# EAGLE design fact-atmega32u4 (EAGLE 6.5.0)
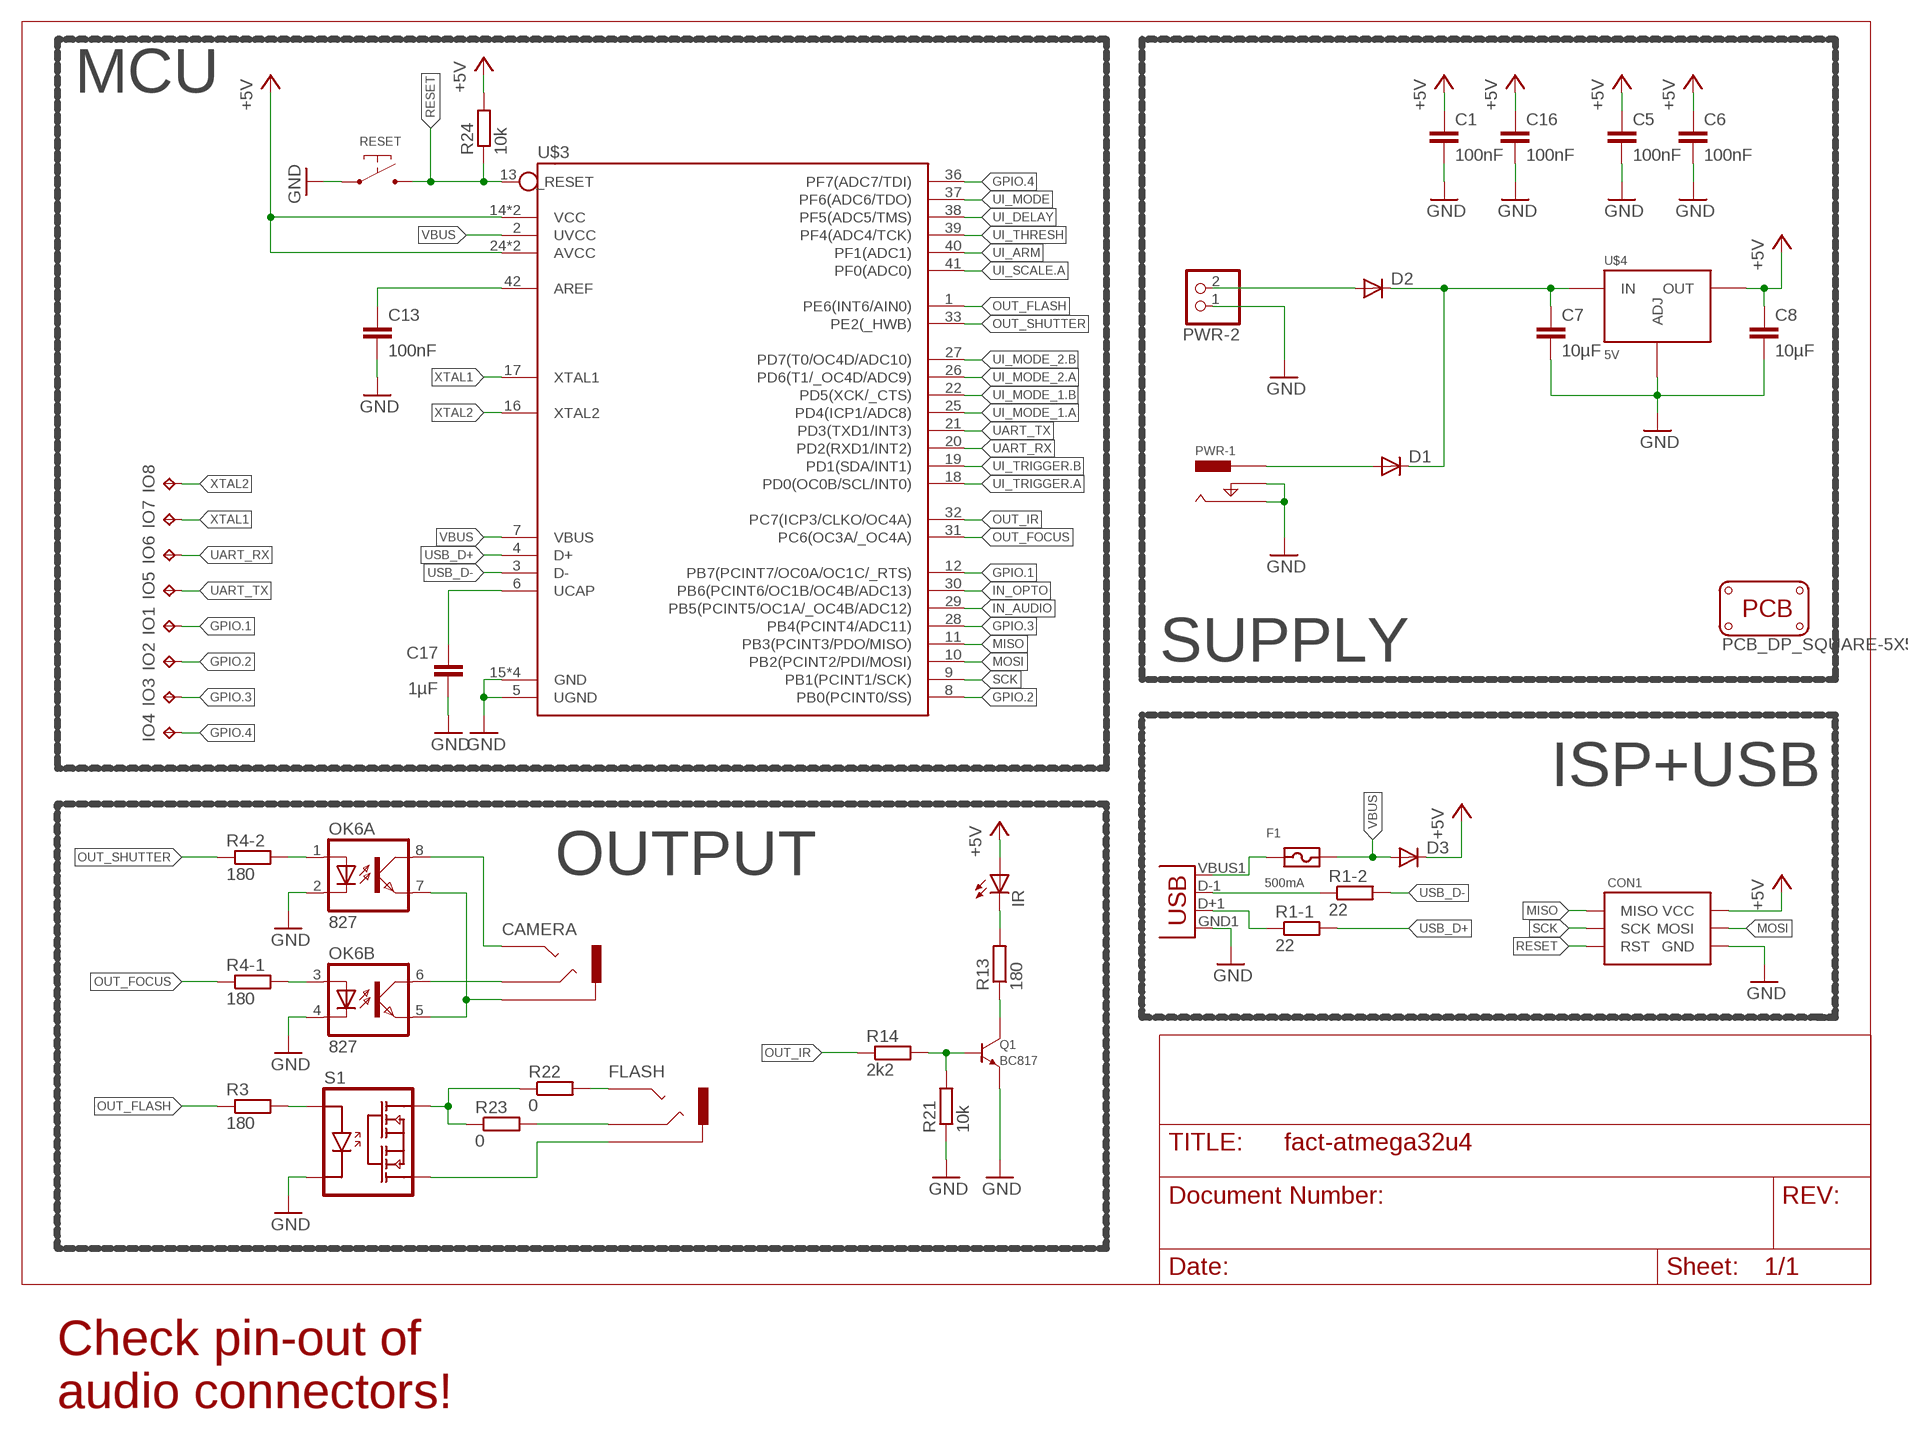
[diagram p0: schematic, sheet 1, part 1 of 2]
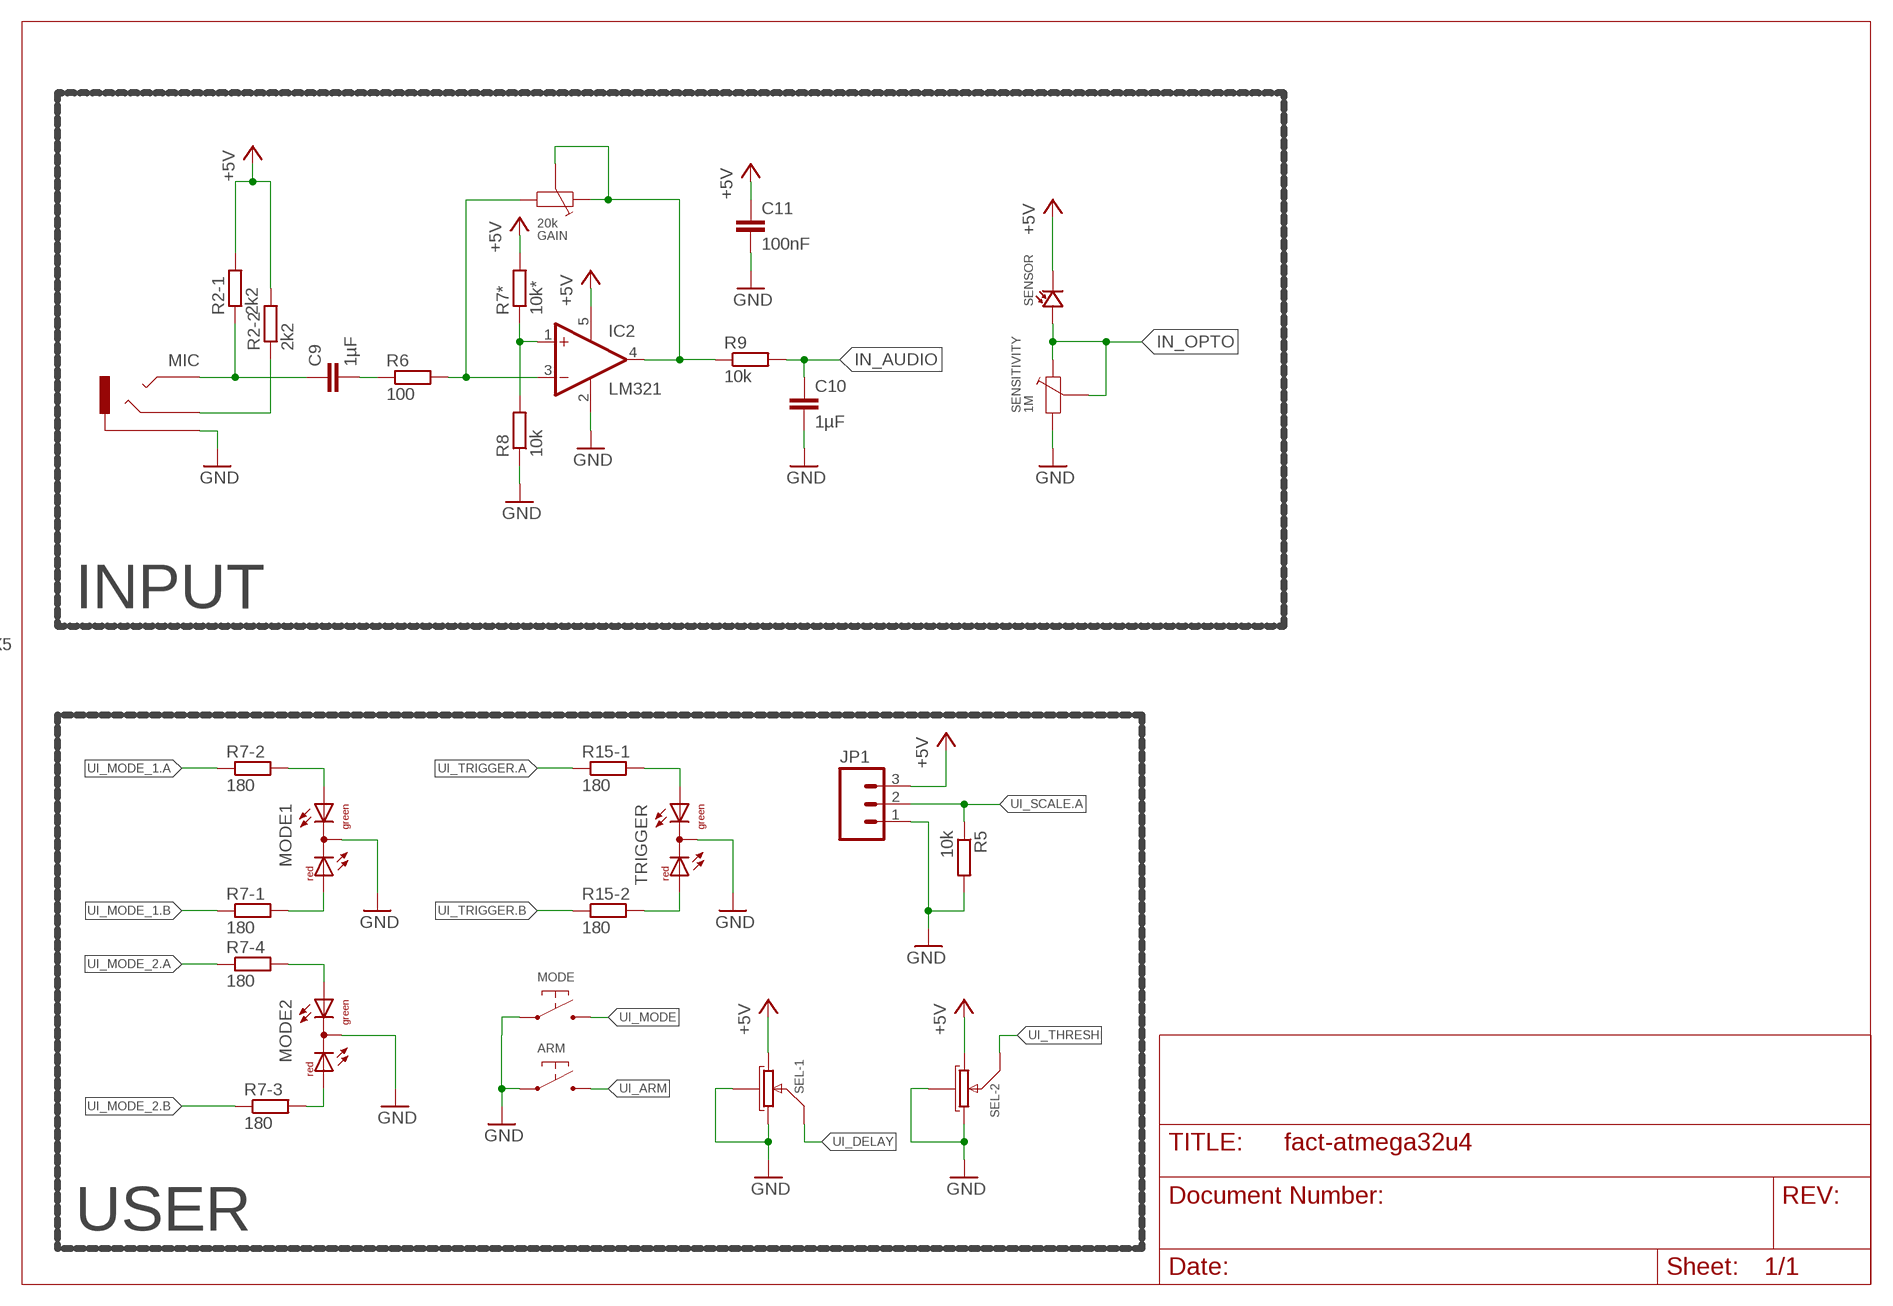
[diagram p1: schematic, sheet 1, part 2 of 2]

## Parts
ARM  SWITCH-DEFAULT_OFF-DEFAULT  [SWITCH-GENERIC-4_PIN]
C1  100nF  C-EUC0603  [C0603]
C5  100nF  C-EUC0603  [C0603]
C6  100nF  C-EUC0603  [C0603]
C7  10µF  C-EUC0603  [C0603]
C8  10µF  C-EUC0603  [C0603]
C9  1µF  C-EUC0603  [C0603]
C10  1µF  C-EUC0603  [C0603]
C11  100nF  C-EUC0603  [C0603]
C13  100nF  C-EUC0603  [C0603]
C16  100nF  C-EUC0603  [C0603]
C17  1µF  C-EUC0603  [C0603]
CAMERA  AUDIO-STEREO2MM5  [AUDIO-STEREO-2MM5-SJ1-2503A]
CON1  ISP-6_PIN-POGO  [POGO-1.27-6_PIN-MADWORM]
D1  DIODESOD  [SOD-323]
D2  DIODESOD  [SOD-323]
D3  DIODESOD  [SOD-323]
F1  500mA  FUSE0805  [SMD-0805]
FLASH  AUDIO-STEREODEALEXTREME  [AUDIO-STEREO-3MM5-ST-009]
GAIN  20k  TRIM-POT  [TRIM-POT-CA6-VS5]
IC2  LM321  LM321MF  [SOT23-5]
IO1  TPTP15R  [TP15R]
IO2  TPTP15R  [TP15R]
IO3  TPTP15R  [TP15R]
IO4  TPTP15R  [TP15R]
IO5  TPTP15R  [TP15R]
IO6  TPTP15R  [TP15R]
IO7  TPTP15R  [TP15R]
IO8  TPTP15R  [TP15R]
IR  LED5MM  [LED5MM]
JP1  M03LOCK  [1X03_LOCK]
MIC  AUDIO-STEREODEALEXTREME  [AUDIO-STEREO-3MM5-ST-009]
MODE  SWITCH-DEFAULT_OFF-DEFAULT  [SWITCH-GENERIC-4_PIN]
MODE1  DUOLED-RG-C  [DUOLED-C-5MM]
MODE2  DUOLED-RG-C  [DUOLED-C-5MM]
OK6  827  OPTOCOUPLER-PC827SMD  [SMD08]
PCB1  PCB_DP_SQUARE-5X5  [DP5050_V1]
PWR-1  POWER-BARREL_JACKEBAY  [POWER-BARREL-2MM1-EBAY]
PWR-2  PINHD-1X2  [1X02]
Q1  BC817  TRANSISTOR-NPN-GENERIC-BEC  [SOT23]
R1  22  R-ARRAY-2X-0603  [R-ARRAY-2X-0603]
R2  2k2  R-ARRAY-2X-0603  [R-ARRAY-2X-0603]
R3  180  R-EU_R0603  [R0603]
R4  180  R-ARRAY-2X-0603  [R-ARRAY-2X-0603]
R5  10k  R-EU_R0603  [R0603]
R6  100  R-EU_R0603  [R0603]
R7  180  R-ARRAY-4X0603  [R-ARRAY-4X-CTS-0603]
R7*  10k*  R-EU_R0603  [R0603]
R8  10k  R-EU_R0603  [R0603]
R9  10k  R-EU_R0603  [R0603]
R13  180  R-EU_R0603  [R0603]
R14  2k2  R-EU_R0603  [R0603]
R15  180  R-ARRAY-2X-0603  [R-ARRAY-2X-0603]
R21  10k  R-EU_R0603  [R0603]
R22  0  R-EU_R1206  [R1206]
R23  0  R-EU_R1206  [R1206]
R24  10k  R-EU_R0603  [R0603]
RESET  SWITCH-DEFAULT_OFF-SMD-2_PIN  [SWITCH-SMD-2_PIN-DX]
S1  RELAYLH1500  [SMD-06]
SEL  DUAL-POT  [POT-DUAL-P090]
SENSITIVITY  1M  TRIM-POT  [TRIM-POT-CA6-VS5]
SENSOR  PHOTODIODE  [LED-5MM]
TRIGGER  DUOLED-RG-C  [DUOLED-C-5MM]
U$3  ATMEGA32U4-QFN-HAND  [QFN-44-NOPAD-LONGLEADS]
U$4  5V  REGULATOR-TLV1117SOT223  [SOT223]
U$5  USB  [USB-AB-MICRO-SMD_V03]

## Nets
+5V: C1.1 C5.1 C6.1 C8.1 C11.1 C16.1 CON1.P$2(VCC) D3.1(C) IC2.5(V+) IR.A JP1.3 R2.P$1.2 R2.P$2.2 R7*.2 R24.2 SEL.P1-3(-1:B) SEL.P2-1(-2:A) SENSOR.K(C) U$3.14(VCC) U$3.24(AVCC) U$3.34(VCC) U$3.44(AVCC) U$4.2(OUT) U$4.4(OUT)
GND: ARM.P$1 ARM.P$2 C1.2 C5.2 C6.2 C7.2 C8.2 C10.2 C11.2 C13.2 C16.2 C17.2 CON1.P$6(GND) IC2.2(V-) JP1.1 MIC.P$1.1(SLEEVE) MIC.P$1.2(SLEEVE) MODE1.C MODE2.C MODE.P$1 MODE.P$2 OK6.2(A:C) OK6.4(B:C) PWR-1.P$2(SWITCH) PWR-1.P$3(OUTER) PWR-2.1 Q1.P$2(EMITTER) R5.2 R8.1 R21.1 RESET.P$1 S1.2(LED-C) SEL.CENTER(-1:SHIELD) SEL.G1-S(-1:SHIELD) SEL.G2-S(-2:SHIELD) SEL.P1-1(-1:A) SEL.P2-3(-2:B) SENSITIVITY.P$2 TRIGGER.C U$3.5(UGND) U$3.15(GND) U$3.23(GND) U$3.35(GND) U$3.43(GND) U$4.1(ADJ) U$5.GND1(GND)
GPIO.1: IO1.TP U$3.12(PB7(PCINT7/OC0A/OC1C/_RTS))
GPIO.2: IO2.TP U$3.8(PB0(PCINT0/SS))
GPIO.3: IO3.TP U$3.28(PB4(PCINT4/ADC11))
GPIO.4: IO4.TP U$3.36(PF7(ADC7/TDI))
HV_OUT: R22.1 R23.1 S1.6(R1)
HV_RING: FLASH.P$2(RING) R23.2
HV_SLEEVE: FLASH.P$1.1(SLEEVE) FLASH.P$1.2(SLEEVE) S1.4(R2)
HV_TIP: FLASH.P$3.1(TIP) FLASH.P$3.2(TIP) R22.2
IN_AUDIO: C10.1 R9.2 U$3.29(PB5(PCINT5/OC1A/_OC4B/ADC12))
IN_OPTO: SENSITIVITY.CENTER SENSITIVITY.P$1 SENSOR.A U$3.30(PB6(PCINT6/OC1B/OC4B/ADC13))
MISO: CON1.P$1(MISO) U$3.11(PB3(PCINT3/PDO/MISO))
MOSI: CON1.P$4(MOSI) U$3.10(PB2(PCINT2/PDI/MOSI))
N$2: C7.1 D1.1(C) D2.1(C) U$4.3(IN)
N$3: F1.1 U$5.VBUS1(VBUS)
N$4: R1.P$2.1 U$5.D-1(D-)
N$5: D1.2(A) PWR-1.P$4(CENTER)
N$7: R1.P$1.1 U$5.D+1(D+)
N$9: D2.2(A) PWR-2.2
N$15: CAMERA.P$1(SLEEVE) OK6.5(B:EMIT) OK6.7(A:EMIT)
N$16: CAMERA.P$4(RING) OK6.6(B:COL)
N$17: CAMERA.P$2(TIP) CAMERA.P$3(TIP) OK6.8(A:COL)
N$18: OK6.1(A:A) R4.P$2.2
N$19: MIC.P$2(RING) R2.P$2.1
N$20: C9.1 MIC.P$3.1(TIP) MIC.P$3.2(TIP) R2.P$1.1
N$21: IC2.1(+IN) R7*.1 R8.2
N$22: C9.2 R6.1
N$23: GAIN.P$2 IC2.3(-IN) R6.2
N$24: GAIN.CENTER GAIN.P$1 IC2.4(OUT) R9.1
N$25: R3.2 S1.1(LED-A)
N$26: OK6.3(B:A) R4.P$1.2
N$27: Q1.P$3(COLLECTOR) R13.1
N$28: IR.K(C) R13.2
N$29: Q1.P$1(BASE) R14.2 R21.2
N$30: MODE1.AX(AG) R7.P$2.2
N$31: MODE1.AR R7.P$1.2
N$32: R15.P$1.2 TRIGGER.AX(AG)
N$33: R15.P$2.2 TRIGGER.AR
N$37: MODE2.AX(AG) R7.P$4.2
N$38: MODE2.AR R7.P$3.2
N$39: C13.1 U$3.42(AREF)
N$42: C17.1 U$3.6(UCAP)
OUT_FLASH: R3.1 U$3.1(PE6(INT6/AIN0))
OUT_FOCUS: R4.P$1.1 U$3.31(PC6(OC3A/_OC4A))
OUT_IR: R14.1 U$3.32(PC7(ICP3/CLKO/OC4A))
OUT_SHUTTER: R4.P$2.1 U$3.33(PE2(_HWB))
RESET: CON1.P$5(RST) R24.1 RESET.P$2 U$3.13(_RESET)
SCK: CON1.P$3(SCK) U$3.9(PB1(PCINT1/SCK))
UART_RX: IO6.TP U$3.20(PD2(RXD1/INT2))
UART_TX: IO5.TP U$3.21(PD3(TXD1/INT3))
UI_ARM: ARM.P$3 ARM.P$4 U$3.40(PF1(ADC1))
UI_DELAY: SEL.P1-2(-1:M) U$3.38(PF5(ADC5/TMS))
UI_MODE: MODE.P$3 MODE.P$4 U$3.37(PF6(ADC6/TDO))
UI_MODE_1.A: R7.P$2.1 U$3.25(PD4(ICP1/ADC8))
UI_MODE_1.B: R7.P$1.1 U$3.22(PD5(XCK/_CTS))
UI_MODE_2.A: R7.P$4.1 U$3.26(PD6(T1/_OC4D/ADC9))
UI_MODE_2.B: R7.P$3.1 U$3.27(PD7(T0/OC4D/ADC10))
UI_SCALE.A: JP1.2 R5.1 U$3.41(PF0(ADC0))
UI_THRESH: SEL.P2-2(-2:M) U$3.39(PF4(ADC4/TCK))
UI_TRIGGER.A: R15.P$1.1 U$3.18(PD0(OC0B/SCL/INT0))
UI_TRIGGER.B: R15.P$2.1 U$3.19(PD1(SDA/INT1))
USB_D+: R1.P$1.2 U$3.4(D+)
USB_D-: R1.P$2.2 U$3.3(D-)
VBUS: D3.2(A) F1.2 U$3.2(UVCC) U$3.7(VBUS)
XTAL1: IO7.TP U$3.17(XTAL1)
XTAL2: IO8.TP U$3.16(XTAL2)

## Notes on the sheet
- MCU
- INPUT
- SUPPLY
- ISP+USB
- OUTPUT
- USER
- Check pin-out of
  audio connectors!

## Library data of the parts
ARM MODE RESET = p.peter-passives:SWITCH-DEFAULT_OFF
C1 C5-C11 C13 C16 C17 = p.peter-rcl:C-EU: CAPACITOR, European symbol
CAMERA = p.peter-connectors:AUDIO-STEREO: Conrad 3.5mm Stereo 0.66EUR Best.-Nr.: 733962 - 62; OC_DIGIKEY: CP1-2503A-ND
CON1 = p.peter-connectors:ISP-6_PIN: AVR 6 PIN ISP header Edge connector normal layout
D1-D3 = SparkFun-DiscreteSemi:DIODE: Diode These are standard reverse protection diodes and small signal diodes. SMA package can handle up to about 1A. SOD-323 can handle about 200mA. What the SOD-323 package when ordering, there are some mfgs out there that are 5-pin packages.; PROD_ID: DIO-09646
F1 = p.peter-regulators:FUSE
FLASH MIC = p.peter-connectors:AUDIO-STEREO: Conrad 3.5mm Stereo 0.66EUR Best.-Nr.: 733962 - 62; DX: http://dx.com/p/st-009-diy-3-5mm-stereo-audio-jack-20-piece-pack-123457; OC_CONRAD: 733962 - 62
GAIN SENSITIVITY = p.peter-passives:TRIM-POT
IC2 = linear:LM321?*: Low Power Single Op Amp Source: http://cache.national.com/ds/LM/LM321.pdf
IO1-IO8 = testpad:TP: Test pad
IR = led:LED: LED OSRAM: - CHIPLED LG R971, LG N971, LY N971, LG Q971, LY Q971, LO R971, LY R971 LH N974, LH R974 LS Q976, LO Q976, LY Q976 LO Q996 - Hyper CHIPLED LW Q18S LB Q993, LB Q99A, LB R99A - SideLED LS A670, LO A670, LY A670, LG A670, LP A670 LB A673, LV A673, LT A673, LW A673 LH A674 LY A675 LS A676, LA A676, LO A676, LY A676, LW A676 LS A679, LY A679, LG A679 - Hyper Micro SIDELED® LS Y876, LA Y876, LO Y876, LY Y876 LT Y87S - SmartLED LW L88C, LW L88S LB L89C, LB L89S, LG L890 LS L89K, LO L89K, LY L89K LS L896, LA L896, LO L896, LY L896 - TOPLED LS T670, LO T670, LY T670, LG T670, LP T670 LSG T670, LSP T670, LSY T670, LOP T670, LYG T670 LG T671, LOG T671, LSG T671 LB T673, LV T673, LT T673, LW T673 LH T674 LS T676, LA T676, LO T676, LY T676, LB T676, LH T676, LSB T676, LW T676 LB T67C, LV T67C, LT T67C, LS T67K, LO T67K, LY T67K, LW E67C LS E67B, LA E67B, LO E67B, LY E67B, LB E67C, LV E67C, LT E67C LW T67C LS T679, LY T679, LG T679 LS T770, LO T770, LY T770, LG T770, LP T770 LB T773, LV T773, LT T773, LW T773 LH T774 LS E675, LA E675, LY E675, LS T675 LS T776, LA T776, LO T776, LY T776, LB T776 LHGB T686 LT T68C, LB T68C - Hyper Mini TOPLED® LB M676 - Mini TOPLED Santana® LG M470 LS M47K, LO M47K, LY M47K Source: http://www.osram.convergy.de LUXEON: - LUMILED® LXK2-PW12-R00, LXK2-PW12-S00, LXK2-PW14-U00, LXK2-PW14-V00 LXK2-PM12-R00, LXK2-PM12-S00, LXK2-PM14-U00 LXK2-PE12-Q00, LXK2-PE12-R00, LXK2-PE12-S00, LXK2-PE14-T00, LXK2-PE14-U00 LXK2-PB12-K00, LXK2-PB12-L00, LXK2-PB12-M00, LXK2-PB14-N00, LXK2-PB14-P00, LXK2-PB14-Q00 LXK2-PR12-L00, LXK2-PR12-M00, LXK2-PR14-Q00, LXK2-PR14-R00 LXK2-PD12-Q00, LXK2-PD12-R00, LXK2-PD12-S00 LXK2-PH12-R00, LXK2-PH12-S00 LXK2-PL12-P00, LXK2-PL12-Q00, LXK2-PL12-R00 Source: www.luxeon.com KINGBRIGHT: KA-3528ASYC Source: www.kingbright.com
JP1 = SparkFun-Connectors:M03: Header 3 Standard 3-pin 0.1" header. Use with straight break away headers (SKU : PRT-00116), right angle break away headers (PRT-00553), swiss pins (PRT-00743), machine pins (PRT-00117), and female headers (PRT-00115). Molex polarized connector foot print use with SKU : PRT-08232 with associated crimp pins and housings.
MODE1 MODE2 TRIGGER = led:DUOLED-RG-C: DUO LED 2 colors (red/green), 5 mm, round, common Cathode www.ligitek.com or other producers.; OC_DIGIKEY: WP59EGC
OK6 = p.peter-ics:OPTOCOUPLER-PC827: SHARP OPTO COUPLER
PCB1 = dp_pcb:PCB_DP_SQUARE: Dangerous Prototypes Standard Square PCB sizes
PWR-1 = p.peter-connectors:POWER-BARREL_JACK
PWR-2 = pinhead:PINHD-1X2: PIN HEADER
Q1 = p.peter-ics:TRANSISTOR-NPN-GENERIC
R1 R2 R4 R15 = p.peter-rcl:R-ARRAY-2X
R3 R5 R6 R7* R8 R9 R13 R14 R21 R24 = p.peter-rcl:R-EU_: RESISTOR, European symbol
R7 = p.peter-rcl:R-ARRAY-4X
R22 R23 = rcl:R-EU_: RESISTOR, European symbol
S1 = p.peter-ics:RELAY
SEL = p.peter-passives:DUAL-POT
SENSOR = p.peter-leds:PHOTODIODE
U$3 = p.peter-ics:ATMEGA32U4
U$4 = p.peter-regulators:REGULATOR-TLV1117
U$5 = p.peter-connectors:USB

## Board
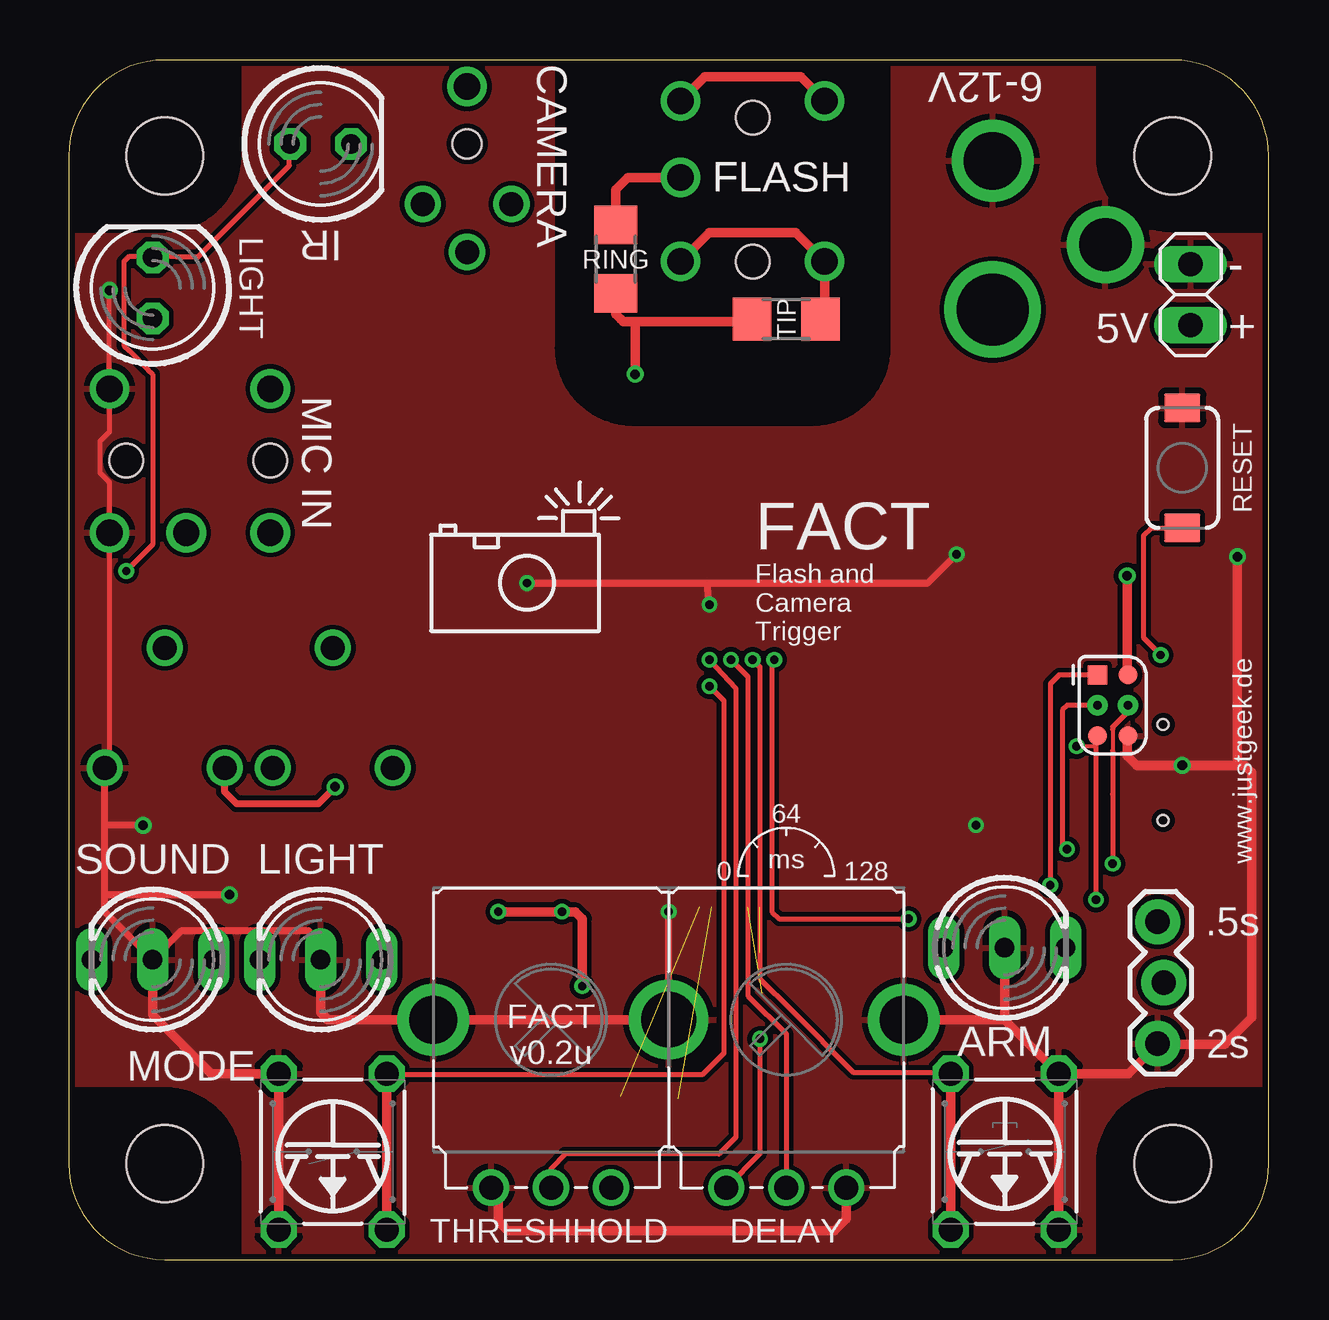
[diagram p2: board, top side]
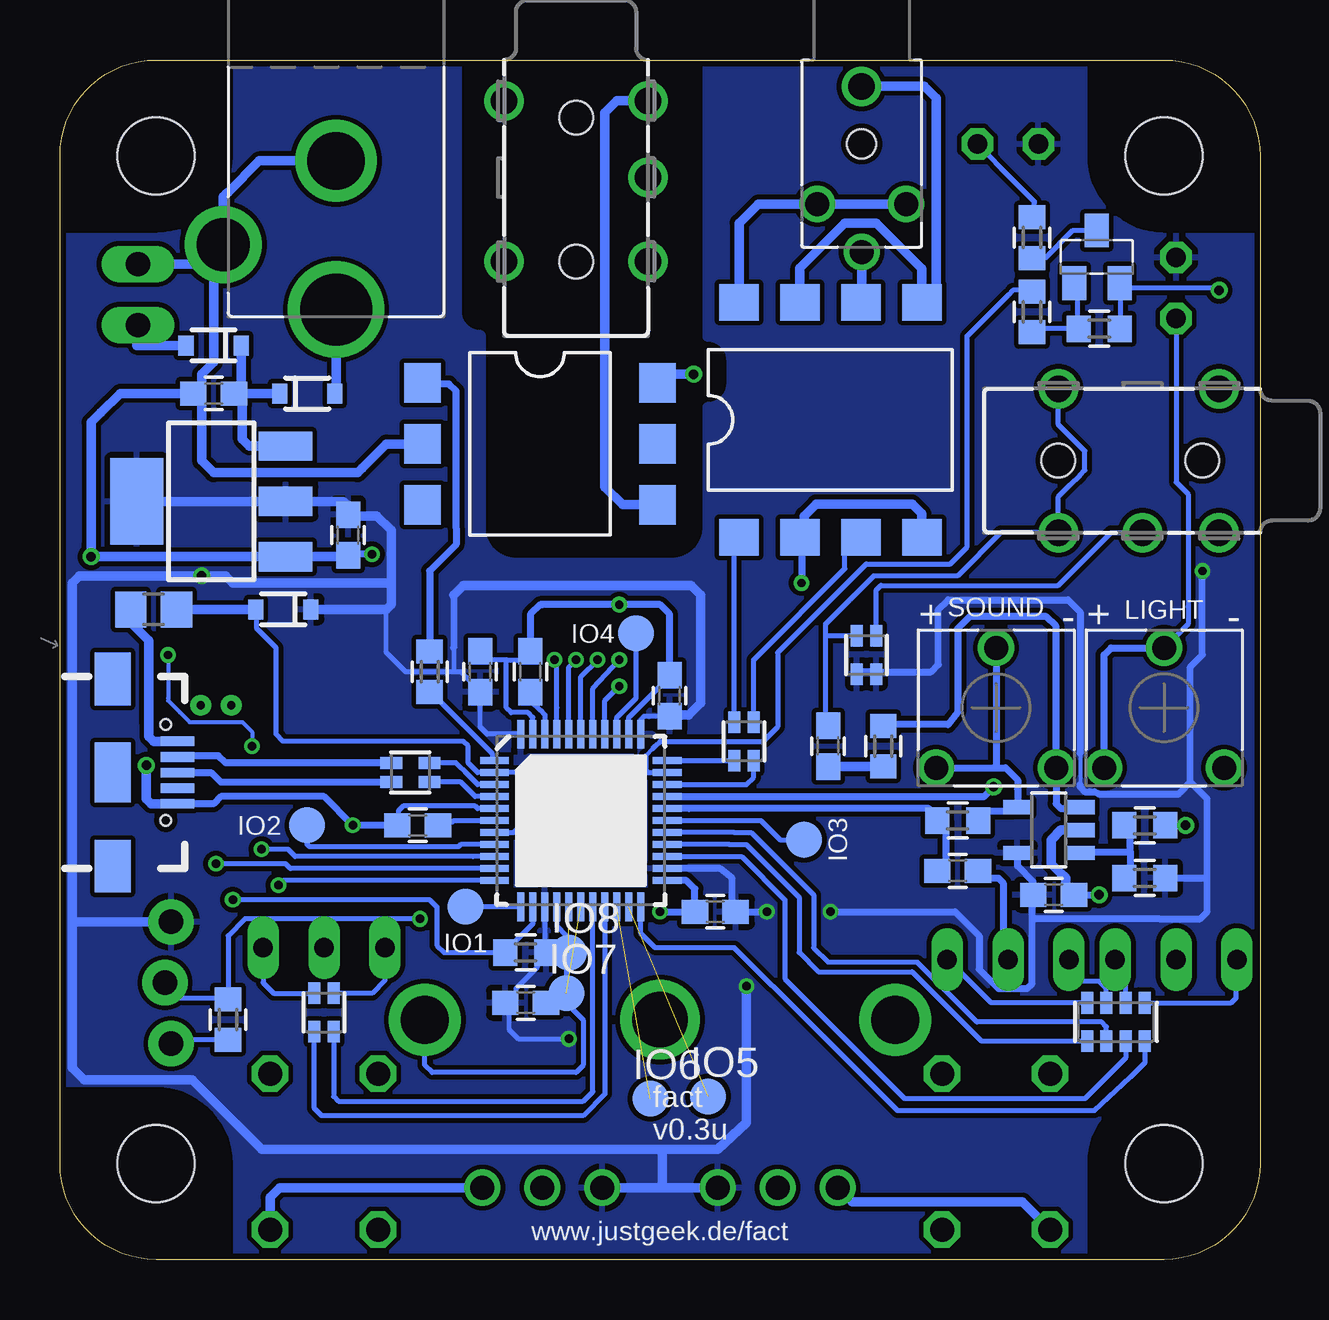
[diagram p3: board, bottom side, seen from below]

Size 50 x 50 mm. Coordinates in mm from the lower left corner, seen from the top.
Copper layers (1*16): Top 0.035mm / dielectric 1.5mm / Bottom 0.035mm
Design rules "Fusion_eagle_rule_v1.1 *": minimum track width 6mil, minimum drill 12mil, track to track 6mil, track to pad 6mil, pad to pad 6mil, via to via 6mil, smd to smd 0mil, copper to edge 10mil, drill to drill 10mil, minimum pad ring 10mil, minimum via ring 6mil, stop-mask expansion 2mil, vias tented up to drill 100mil, thermal gap 10mil
tRestrict: 5 lines
bRestrict: 16 lines

### Footprints (pad centres in the part's own frame; a part is rotated, then mirrored left to right if it is on the bottom)
SWITCH-GENERIC-4_PIN = drill 1 octagon: P$1 2.25,3.25; P$2 2.25,-3.25; P$3 -2.25,3.25; P$4 -2.25,-3.25
C0603 = smd 1.1 x 1: 1 -0.85,0; 2 0.85,0
AUDIO-STEREO-2MM5-SJ1-2503A = drill 1.1: P$1 -2.4,0 | drill 1: P$2 2.5,-1.85; P$3 2.5,1.85; P$4 4.5,0 | hole 1.2: 0,0
POGO-1.27-6_PIN-MADWORM = smd 0.8 x 0.8: P$1 -1.27,-0.635; P$2 -1.27,0.635; P$5 1.27,-0.635; P$6 1.27,0.635 | drill 0.35: P$3 0,-0.635; P$4 0,0.635
SOD-323 = smd 0.63 x 0.83: 1 -1.15,0; 2 1.15,0
SMD-0805 = smd 1.3 x 1.5: 1 -0.95,0; 2 0.95,0
AUDIO-STEREO-3MM5-ST-009 = drill 1.1: P$1.1 -2.8,-3; P$1.2 -2.8,3; P$2 0.4,3; P$3.1 3.9,-3; P$3.2 3.9,3 | hole 1.4: 3.9,0; -2.1,0
TRIM-POT-CA6-VS5 = drill 1: CENTER 0,2.5; P$1 -2.5,-2.5; P$2 2.5,-2.5
SOT23-5 = smd 0.6 x 1.2: 1 -0.95,-1.306; 2 0,-1.306; 3 0.95,-1.306; 4 0.95,1.306; 5 -0.95,1.306
TP15R = smd 1.5 x 1.5: TP 0,0
LED5MM = drill 0.813 octagon: A -1.27,0; K 1.27,0
1X03_LOCK = drill 1.016 pad 1.88: 1 0,0.127; 2 2.54,-0.127; 3 5.08,0.127
DUOLED-C-5MM = drill 0.813 long: AR 2.54,0; AX -2.54,0; C 0,0
SMD08 = smd 1.651 x 1.524: 1 -3.81,-4.889; 2 -1.27,-4.889; 3 1.27,-4.889; 4 3.81,-4.889; 5 3.81,4.889; 6 1.27,4.889; 7 -1.27,4.889; 8 -3.81,4.889
DP5050_V1 = hole 3.2: 4,4; 46,4; 46,46; 4,46
POWER-BARREL-2MM1-EBAY = drill 2.2: P$2 0.5,-4.7 | drill 2.4: P$3 -3,0 | drill 3: P$4 3.2,0
1X02 = drill 1.016 long: 1 -1.27,0; 2 1.27,0
SOT23 = smd 1 x 1.4: P$1 -0.95,-1.1; P$2 0.95,-1.1; P$3 0,1.1
R-ARRAY-2X-0603 = smd 0.5 x 0.9: P$1.1 -0.4,0.8; P$1.2 -0.4,-0.8; P$2.1 0.4,0.8; P$2.2 0.4,-0.8
R0603 = smd 1 x 1.1: 1 -0.85,0; 2 0.85,0
R-ARRAY-4X-CTS-0603 = smd 0.5 x 0.9: P$1.1 -1.2,0.8; P$1.2 -1.2,-0.8; P$2.1 -0.4,0.8; P$2.2 -0.4,-0.8; P$3.1 0.4,0.8; P$3.2 0.4,-0.8; P$4.1 1.2,0.8; P$4.2 1.2,-0.8
R1206 = smd 1.6 x 1.803: 1 -1.422,0; 2 1.422,0
SWITCH-SMD-2_PIN-DX = smd 1.2 x 1.5: P$1 -2.5,0; P$2 2.5,0
SMD-06 = smd 1.651 x 1.524: 1 -2.54,-4.889; 2 0,-4.889; 3 2.54,-4.889; 4 2.54,4.889; 5 0,4.889; 6 -2.54,4.889
POT-DUAL-P090 = drill 2.3: CENTER 0,0 | drill 2: G1-S -9.8,0; G2-S 9.8,0 | drill 1: P1-1 -7.4,-7; P1-2 -4.9,-7; P1-3 -2.4,-7; P2-1 2.4,-7; P2-2 4.9,-7; P2-3 7.4,-7
LED-5MM = drill 0.813 octagon: A -1.27,0; K 1.27,0
QFN-44-NOPAD-LONGLEADS = smd 1.2 x 0.3: 1 -3.6,2.5; 2 -3.6,2; 3 -3.6,1.5; 4 -3.6,1; 5 -3.6,0.5; 6 -3.6,0; 7 -3.6,-0.5; 8 -3.6,-1; 9 -3.6,-1.5; 10 -3.6,-2; 11 -3.6,-2.5; 23 3.6,-2.5; 24 3.6,-2; 25 3.6,-1.5; 26 3.6,-1; 27 3.6,-0.5; 28 3.6,0; 29 3.6,0.5; 30 3.6,1; 31 3.6,1.5; 32 3.6,2; 33 3.6,2.5 | smd 0.3 x 1.2: 12 -2.5,-3.6; 13 -2,-3.6; 14 -1.5,-3.6; 15 -1,-3.6; 16 -0.5,-3.6; 17 0,-3.6; 18 0.5,-3.6; 19 1,-3.6; 20 1.5,-3.6; 21 2,-3.6; 22 2.5,-3.6; 34 2.5,3.6; 35 2,3.6; 36 1.5,3.6; 37 1,3.6; 38 0.5,3.6; 39 0,3.6; 40 -0.5,3.6; 41 -1,3.6; 42 -1.5,3.6; 43 -2,3.6; 44 -2.5,3.6
SOT223 = smd 1.219 x 2.235: 1 -2.311,-3.099; 2 0,-3.099; 3 2.311,-3.099 | smd 3.6 x 2.2: 4 0,3.099
USB-AB-MICRO-SMD_V03 = smd 1.4 x 0.4: D+1 2.7,0; D-1 2.7,0.65; GND1 2.7,-1.3; ID1 2.7,-0.65; VBUS1 2.7,1.3 | smd 1.5 x 2.2: P$1 0,3.9; P$2 0,-3.9 | smd 1.5 x 2.5: P$3 0,0 | hole 0.45: 2.2,2; 2.2,-2

### Placement (x,y rotation side)
ARM  39,4.5 0 top
C1  32.5,24.5 90 bottom
C5  30.6,10.7 0 bottom
C6  24.6,23.5 90 bottom
C7  43.6,36.1 180 bottom
C8  38,30.2 270 bottom
C9  18,21.4 270 bottom
C10  12.6,16.2 0 bottom
C11  8.6,15.2 0 bottom
C13  30.4,24.5 90 bottom
C16  22.7,14.5 180 bottom
C17  35.1,18.1 180 bottom
CAMERA  16.6,46.5 270 bottom
CON1  43.5,23.1 270 top
D1  39.7,36.1 0 bottom
D2  43.6,38.1 180 bottom
D3  40.7,27.1 180 bottom
F1  46.1,27.1 0 bottom
FLASH  28.5,45.5 270 bottom
GAIN  11,23 0 bottom
IC2  8.8,17.9 90 bottom
IO1  33.1,14.7 0 bottom
IO2  39.7,18.1 0 bottom
IO3  19,17.5 0 bottom
IO4  26,26.1 0 bottom
IO5  23,6.8 0 bottom
IO6  25.4,6.7 0 bottom
IO7  28.9,11.1 0 bottom
IO8  28.8,12.8 0 bottom
IR  10.5,46.5 0 top
JP1  45.5,9 90 top
MIC  4.5,33.3 180 bottom
MODE  11,4.5 180 top
MODE1  3.5,12.5 180 top
MODE2  10.5,12.5 180 top
OK6  17.9,35 0 bottom
PCB1  0,0 0 top
PWR-1  38.5,42.8 270 bottom
PWR-2  46.75,40.22 270 top
Q1  6.8,41.8 0 bottom
R1  35.4,20.3 90 bottom
R2  16.4,25.2 0 bottom
R3  34.6,24.5 90 bottom
R4  21.5,21.6 180 bottom
R5  43,10 270 bottom
R6  15.7,21.4 90 bottom
R7  6,9.9 180 bottom
R7*  4.8,15.9 0 bottom
R8  4.8,18.1 180 bottom
R9  12.6,18.3 180 bottom
R13  9.5,42.6 90 bottom
R14  9.5,39.5 270 bottom
R15  39,10.3 180 bottom
R21  6.7,38.8 180 bottom
R22  29.9,39.2 0 top
R23  22.8,41.7 90 top
R24  30.6,12.8 0 bottom
RESET  46.4,33 270 top
S1  30,34 270 bottom
SEL  25,10 0 top
SENSITIVITY  4,23 0 bottom
SENSOR  3.5,40.5 90 top
TRIGGER  39,13 0 top
U$1  [LOGO-JUSTGEEK-XS]  39,4.4 0 top
U$2  [LOGO-JUSTGEEK-XS]  11,4.3 0 top
U$3  28.3,18.3 0 bottom
U$4  43.7,31.6 90 bottom
U$5  47.8,20.3 0 bottom
U$6  [LOGO-JUSTGEEK-XXXS-MASK]  47,27.6 90 top
U$7  [LOGO-JUSTGEEK-XXXS-MASK]  19.6,6.4 0 bottom

### Tracks (layer width: path | path; a pad name or v marks a point on that pad's centre or on a via)
+5V  (via drill 0.35, 0.4)
  Top 0.2: IR.A 9.2,46.5 9.2,45.6 5.4,41.8 4.5,41.8 3.53,41.8 | 3.53,41.8 2.5,41.8 2.3,41.6 2.3,38.1 2.5,37.9 3.3,37.1 3.5,36.9 3.5,29.8 v2.4,28.7 | v28.8,9.2 28.8,4.4 SEL.P2-1 | 3.53,41.8 SENSOR.K
  Top 0.4: CON1.P$2 44.13,24.27 44.1,24.3 44.1,26.4 44.1,27.1 44.1,28.1 v44.1,28.5 | v21.4,11.4 21.4,14.2 21.1,14.5 v20.55,14.5 v17.9,14.5
  Bottom 0.16: 7.5,21.1 7.5,19.8
  Bottom 0.2: 25.8,22.1 U$3.34 25.8,22.5 25.65,22.65 C6.1 | 30.8,21.8 U$3.44 32.2,21.9 32.5,22.2 C1.1 32.5,23.7 33.3,24.5 33.6,24.5 | 33.6,24.5 35.6,24.5 36.4,25.3 36.4,27.1 | C6.1 24.25,22.65 | 24.25,22.65 24.2,22.7 | 33.6,25.5 33.6,24.5 | 24.25,22.65 C6.1 | U$3.14 29.8,12.85 R24.2 30.1,12.45 30.1,12.2 30.2,12.1 30.6,11.7 31,11.3 31,11 31.3,10.7 | C5.1 31.3,10.7 | 31.3,10.7 31.3,9.6 30.9,9.2 v28.8,9.2
  Bottom 0.3: IC2.5 10.1,16.4 9.45,15.75 C11.1 9.5,15.15 9.5,14.4 9.5,14.2 | U$3.24 22.5,16.3 22,15.9 22,14.5 C16.1 v20.55,14.5 | 33.6,27.7 33.6,25.5 | 2.2,15.9 2.2,14.5 2.5,14.2 4.2,14.2 9.5,14.2 | 2.2,15.9 2.2,19.2 2.9,19.9 | 2.9,19.9 2.9,24.7 2.4,25.2 v2.4,28.7 | R7*.2 4,15.9 2.2,15.9 | v17.9,14.5 12.7,14.5 11.7,13.5 11.7,12.1 10.9,11.3 9.7,11.3 9.5,11.5 9.5,14.2 | R2.P$2.2 16,24.5 | 16,24.5 16.7,24.5 | 16.7,24.5 16.8,24.5 R2.P$1.2 16.9,24.4 16.7,24.5 | 16.7,24.5 16,24.5 | 16,24.5 13.7,24.5 13.4,24.8 13.4,27.1 13,27.5 8,27.5 7.5,27 7.5,21.1 | 7.5,19.8 7.5,19.7 7.3,19.5 7.1,19.5 6.9,19.5 6.7,19.4 3.4,19.4 3.3,19.5 2.9,19.9
  Bottom 0.4: U$4.4 U$4.2 38.2,31.6 38,31.4 C8.1 37.95,31 36.8,31 36.2,30.4 36.2,28.2 | D3.1 36.8,27.1 36.4,27.1 | 36.4,27.1 36.2,27.3 | 36.2,27.3 36.2,28.2 | JP1.3 48.88,14.08 49.42,14.08 49.5,14 | 36.2,28.2 37.3,28.2 42.8,28.2 43.1,28.5 v44.1,28.5 49.2,28.5 49.5,28.2 49.5,14.7 49.5,14 | 36.4,27.1 36.2,27.3 | 24.2,22.7 23.8,22.7 23.3,23.2 23.3,27.7 23.7,28.1 33.2,28.1 33.6,27.7 | 49.5,14 49.5,8 49,7.5 44.5,7.5 41.6,4.6 32.9,4.6 24.9,4.6 | 24.9,4.6 22.6,4.6 | 22.6,4.6 21.4,5.7 v21.4,11.4 | SEL.P1-3 24.8,3 | 24.8,3 SEL.P2-1 | 22.6,4.6 24.9,4.6 | 24.9,4.6 24.9,3.1 24.8,3
  pour Bottom (isolate 0.2, rank 2): 0,0 0,50 50,50 50,0
GND  (via drill 0.35, 0.4)
  Top 0.2: v1.7,40.4 MIC.P$1.1 1.7,34.5 1.3,34.1 1.3,32.8 1.7,32.4 MIC.P$1.2 1.7,20.7 SENSITIVITY.P$2
  Top 0.3: v3.1,18.1 1.5,18.1 | 1.5,18.1 SENSITIVITY.P$2 | 1.5,15.3 1.5,14.5 MODE1.C 4.7,13.7 10,13.7 10.5,13.2 MODE2.C | 1.5,15.3 1.5,18.1 | v6.7,15.2 1.6,15.2 1.5,15.3 | SEL.CENTER v25,14.5 | v19.1,28.2 26.6,28.2 | 26.6,28.2 35.8,28.2 v37,29.4 | v26.7,27.3 26.6,28.2
  Top 0.4: MODE.P$1 8.75,2.5 MODE.P$2 5.95,7.75 3.5,10.2 MODE1.C | SEL.P2-3 32.4,1.7 31.9,1.2 18.3,1.2 17.9,1.6 17.9,2.7 SEL.P1-1 | 41.25,2.15 ARM.P$2 ARM.P$1 | ARM.P$1 44.15,7.75 44.5,8.1 45.4,8.97 | MODE2.C 10.5,10.3 10.8,10 SEL.G1-S SEL.CENTER | SEL.G2-S 37.9,10 39,10 | 39,10 TRIGGER.C | 39,10 ARM.P$1 | 44.3,21.7 44.27,21.73 CON1.P$6 44.1,21.8 44.1,21 44.5,20.6 v46.4,20.6 48.7,20.6 | 45.4,8.97 48.17,8.97 49.3,10.1 49.3,20.3 49,20.6 48.7,20.6 | 45.4,8.97 JP1.1 | v48.7,29.3 48.7,20.6
  Bottom 0.2: U$3.5 32.6,18.8 32.7,18.9 35.7,18.9 35.9,18.7 35.9,18.3 35.8,18.2 C17.2 | R21.1 5.8,38.95 5.8,40.35 5.65,40.5 | v1.7,40.4 1.8,40.5 5.65,40.5 | U$3.35 26.3,22.6 25.8,23.1 25.3,23.6 25,23.9 25,23.95 C6.2 | U$3.43 30.3,22.6 30.5,22.8 31.2,22.8 31.4,23 31.4,25 | 31.4,25 30.45,25 C13.2 | 31.4,25 32.45,25 C1.2 | R5.2 45.22,9.15 JP1.1 | U$3.15 29.3,13.9 28.9,13.5 28.9,11 28.9,10.7 | 28.9,10.7 C5.2 | 28.9,10.7 28.2,10 28.2,8.1 28.5,7.8 34.5,7.8 34.8,8.1 SEL.G2-S | 5.65,40.5 Q1.P$2
  Bottom 0.3: R8.1 v3.1,18.1 | 8,15.2 C11.2 | C11.2 v6.7,15.2 | C11.2 8,15.2 | 8,15.2 8.05,15.25 | C10.2 11.7,16.2 11.4,15.9 10.9,15.9 10.7,15.7 10.7,12.7 MODE2.C | U$3.23 23.9,15.8 23.55,15.45 C16.2 v25,14.5 | C17.2 v37.8,18.1 39,19.3 43.3,19.3 43.6,19 U$5.GND1 | C6.2 24.6,26.9 25,27.3 v26.7,27.3 29.9,27.3 30,27.3 30.4,26.9 C13.2 | OK6.2 19.11,30.11 19.1,30.1 v19.1,28.2 | v37,29.4 37.95,29.4 C8.2
  Bottom 0.4: IC2.2 8.3,17.9 8.7,17.5 8.7,16.5 8.3,16.1 8.1,15.9 8.1,15.3 8.05,15.25 8,15.2 | SEL.P1-1 17,2.4 10.35,2.4 9.9,2.4 MODE.P$1 | PWR-1.P$3 41.7,45.8 43,44.5 43.1,44.4 43.2,44.3 PWR-1.P$2 44,41.5 | PWR-2.1 46.71,41.49 46.7,41.5 44.7,41.5 44,41.5 | C7.2 44.1,36.1 | 44.1,36.1 44.15,36.15 | 44.15,36.15 44.1,36.2 44.1,36.9 43.6,37.4 43.6,41.1 44,41.5 | 44.1,36.1 47.5,36.1 48.3,35.3 48.7,34.9 48.7,29.8 v48.7,29.3 | v48.7,29.3 45.9,29.3 | 45.9,29.3 45.6,29.3 45.9,29.3 | 45.9,29.3 v48.7,29.3 | v48.7,29.3 45.9,29.3 | 45.9,29.3 40.61,29.3 U$4.1 40.51,29.29 40.5,29.3 38.05,29.3 C8.2 | 44.1,36.1 44.1,33.3 43.6,32.8 37.6,32.8 37.4,33 36.4,34 S1.2 | 44.1,36.1 44.15,36.15 | U$5.GND1 46.2,19 46.4,19.2 46.4,19.6 v46.4,20.6 | OK6.4 14.09,31.09 14.5,31.5 18.5,31.5 19,31 19,30.28 OK6.2 | SEL.P2-3 40.85,3 41.25,2.6 ARM.P$2
  pour Top (isolate 0.2, rank 2): 0,0 0,50 50,50 50,0
GPIO.1
  Bottom 0.2: U$3.12 IO1.TP
GPIO.2
  Bottom 0.2: U$3.8 33.3,17.3 33.4,17.2 39.6,17.2 39.7,17.3 IO2.TP
GPIO.3
  Bottom 0.2: U$3.28 20.8,18.3 20,17.5 IO3.TP
GPIO.4
  Bottom 0.2: U$3.36 26.8,22.6 26,23.4 IO4.TP
HV_OUT  (via drill 0.4)
  Top 0.4: R22.1 28.48,39.18 28.4,39.1 24.5,39.1 23.6,39.1 | 23.6,39.1 v23.6,36.9 | R23.1 22.8,39.7 22.8,39.4 23,39.2 23.1,39.1 23.6,39.1
  Bottom 0.4: 25.07,36.5 S1.6 25.1,36.9 v23.6,36.9
HV_RING
  Top 0.4: FLASH.P$2 23.3,45.1 22.8,44.6 R23.2 | R23.2 22.8,42.8 R23.2
HV_SLEEVE
  Top 0.4: FLASH.P$1.2 26.5,49.3 30.5,49.3 FLASH.P$1.1
  Bottom 0.4: FLASH.P$1.2 26.8,48.3 27.3,47.8 27.3,32.2 26.56,31.46 S1.4
HV_TIP
  Top 0.4: FLASH.P$3.2 26.7,42.8 30.3,42.8 FLASH.P$3.1 31.5,40.5 31.5,39.38 R22.2
IN_AUDIO
  Bottom 0.3: R9.2 13.2,18.3 | 13.2,18.3 13.1,18.3 13.1,16.3 13.2,16.2 C10.1 | R9.2 13.5,18.2 R9.2 | R9.2 13.2,18.3 | 13.2,18.3 13.7,18.7 13.8,18.8 23.8,18.8 U$3.29
IN_OPTO  (via drill 0.4)
  Top 0.3: v11.1,19.7 10.4,19 7,19 6.5,19.5 SENSITIVITY.P$1
  Bottom 0.2: SENSOR.A 3.5,32.4 3,31.9 3,27.2 3,26.5 3.5,26 SENSITIVITY.CENTER
  Bottom 0.3: SENSITIVITY.P$1 6.5,25.2 6.2,25.5 SENSITIVITY.CENTER | U$3.30 11.5,19.3 v11.1,19.7
MISO  (via drill 0.35)
  Top 0.2: CON1.P$1 41.27,24.37 40.9,24 v40.9,15.6
  Bottom 0.2: U$3.11 40.7,15.8 v40.9,15.6
MOSI  (via drill 0.35)
  Top 0.16: 43.5,22.1 43.5,21.2
  Top 0.2: CON1.P$4 44.1,23 44.1,22.8 43.5,22.2 43.5,22.1 | 43.5,21.2 43.5,19.4 43.5,16.7 v43.5,16.5
  Bottom 0.2: U$3.10 40.4,16.3 40.6,16.5 v43.5,16.5
N$2
  Bottom 0.4: D2.1 42.45,36.15 42.4,36.1 | 42.4,36.1 42.5,36.1 | 42.5,36.1 C7.1 | D1.1 40.9,36.1 42.4,36.1 | U$4.3 42.11,33.91 42.4,34.2 42.4,36 42.5,36.1
N$3
  Bottom 0.4: F1.1 47,26.85 47,26.5 46.3,25.8 46.3,25.6 46.3,22.3 46.3,21.8 46.1,21.6 U$5.VBUS1
N$4
  Bottom 0.3: R1.P$2.1 43.1,20.7 43.4,21 44.85,21 U$5.D-1
N$5
  Bottom 0.4: PWR-1.P$4 38.5,39.1 38.5,36.15 D1.2
N$7
  Bottom 0.3: U$5.D+1 43.7,20.3 43.3,19.9 R1.P$1.1
N$9
  Bottom 0.4: 46.8,38.9 PWR-2.2 46.8,38.9 | 46.8,38.9 46.8,38.1 D2.2
N$15
  Bottom 0.4: OK6.7 19.17,41.33 17.3,43.2 16,43.2 14.1,41.3 OK6.5 13.51,39.89 13.5,39.9 13.5,48.4 14,48.9 CAMERA.P$1
N$16
  Bottom 0.4: CAMERA.P$4 16.6,41.7 16.6,39.92 OK6.6
N$17
  Bottom 0.4: CAMERA.P$3 14.8,44 CAMERA.P$2 20.9,44 21.7,43.2 OK6.8
N$18
  Bottom 0.2: R4.P$2.2 21.9,29.92 OK6.1
N$19
  Bottom 0.2: 6.2,30.3 5.9,30.3 | 5.9,30.3 MIC.P$2 | R2.P$2.1 16,27.9 15.8,28.1 8.4,28.1 6.2,30.3 | 6.2,30.3 5.9,30.3
N$20
  Bottom 0.2: MIC.P$3.1 8.4,34.8 7.3,33.7 7.3,32.9 7.5,32.7 7.9,32.3 8.4,31.8 MIC.P$3.2 10.8,30.3 12.6,28.5 16.1,28.5 17.1,27.5 18.1,26.5 18.1,26 | C9.1 17.75,22.25 18.1,22.6 18.1,26 | R2.P$1.1 18.1,26
N$21
  Bottom 0.3: 7.5,17 7.4,17 5.4,17 | 5.4,17 5.4,17.9 5.45,17.9 R8.2 | 5.4,17 5.4,16.15 R7*.1
  Bottom 0.4: R7*.1 5.9,16.1 | IC2.1 7.44,16.9 7.44,16.94 7.5,17
N$22
  Bottom 0.4: C9.2 R6.1
N$23
  Bottom 0.3: IC2.3 7.54,18.8 8.3,18.8 8.5,19 8.5,20.4 GAIN.P$2 8.5,21 8.5,24.55 8.5,26.4 8.9,26.8 12.1,26.8 12.6,26.3 12.6,22.8 13,22.3 15.5,22.3 R6.2
N$24
  Bottom 0.3: R9.1 11.75,18.25 11.4,18.6 11.5,18.7 10.26,18.7 IC2.4 10.1,19.6 10.1,20 10.6,20.5 10.9,20.5 | GAIN.P$1 10.9,20.5 | GAIN.CENTER 11,20.6 10.9,20.5
N$25
  Bottom 0.3: S1.1 34.85,36.5 33.8,36.5 33.5,36.2 33.5,30.5 33.5,29.8 34.6,28.7 R3.2
N$26
  Bottom 0.2: R4.P$1.2 21.1,25 20.6,25.5 17.7,28.4 17.3,28.8 17.3,30.24 OK6.3
N$27
  Bottom 0.2: R13.1 8.95,41.75 7.8,42.9 Q1.P$3
N$28
  Bottom 0.2: IR.K 10.8,45.5 9.4,44.1 R13.2
N$29
  Bottom 0.2: R14.2 9.45,38.8 R21.2 7.6,38.95 7.6,40.55 Q1.P$1
N$30
  Bottom 0.2: R7.P$2.2 5.6,12.06 MODE1.AX
N$31
  Bottom 0.2: R7.P$1.2 1.2,10.7 1,10.9 1,12.46 MODE1.AR
N$32
  Bottom 0.2: TRIGGER.AX 36.46,11.64 37,11.1 R15.P$1.2
N$33
  Bottom 0.2: TRIGGER.AR 41.54,11.54 41.1,11.1 R15.P$2.2
N$37
  Bottom 0.2: R7.P$4.2 11.2,10.7 12.9,12.4 12.96,12.46 13,12.46 MODE2.AX
N$38
  Bottom 0.2: R7.P$3.2 6.4,11.3 6.7,11.6 7.8,11.6 8,11.8 8,12.46 MODE2.AR
N$39
  Bottom 0.2: C13.1 30.4,23.3 30,22.9 29.8,22.7 U$3.42
N$42
  Bottom 0.2: C17.1 33.65,18.25 33.6,18.3 U$3.6
OUT_FLASH
  Bottom 0.2: R3.1 34.55,23.65 32.5,21.6 32,21.1 32,20.9 U$3.1
OUT_FOCUS
  Bottom 0.2: U$3.31 21.4,19.8 21.1,20.1 R4.P$1.1
OUT_IR
  Bottom 0.16: 25.3,21.3 25.6,21
  Bottom 0.2: R14.1 9.55,40.35 9.6,40.4 10.3,40.4 10.5,40.2 12.2,38.5 12.2,29.7 12.9,29 16.4,29 16.8,28.6 17.4,28 18.5,26.9 19.5,25.9 20.1,25.3 20.1,22.2 20.7,21.6 25,21.6 25.2,21.4 25.3,21.3 | 25.6,21 25.6,20.4 25.5,20.3 U$3.32
OUT_SHUTTER
  Bottom 0.2: U$3.33 R4.P$2.1
RESET  (via drill 0.35)
  Top 0.16: CON1.P$5 42.87,22.07 42.9,21.83 42.9,21.6 42.8,21.5 42.8,21.4 v42,21.4 | RESET.P$2 46.1,30.4
  Top 0.2: CON1.P$5 42.87,21.66 42.9,21.6 42.8,21.5 42.8,21.4 42.8,15.5 v42.8,15 | v45.5,25.2 44.8,25.9 44.8,30.2 45.1,30.5 RESET.P$2
  Bottom 0.16: v45.5,25.2 45.5,23.4 45.5,23.3 45,22.8 44.6,22.4 42.4,22.4 42,22 v42,21.4
  Bottom 0.2: v42.8,15 35.3,15 35,15 34.6,15 34.3,14.7 34.3,13.1 34,12.8 31.55,12.8 R24.1 31.1,13.15 31.1,13.2 30.3,14 U$3.13
SCK  (via drill 0.35)
  Top 0.2: CON1.P$3 41.6,23.1 41.4,22.9 41.4,17.3 v41.6,17.1
  Bottom 0.2: U$3.9 32.8,16.8 40.2,16.8 40.5,17.1 v41.6,17.1
UART_RX  (1 unrouted)
UART_TX  (1 unrouted)
UI_ARM  (via drill 0.35)
  Top 0.2: v28.5,25 28.8,24.7 28.8,23.3 28.8,11.7 30.1,10.4 32.7,7.8 36.7,7.8 ARM.P$3 36.7,7.7
  Top 0.4: ARM.P$3 ARM.P$4
  Bottom 0.2: U$3.40 28.8,24.7 v28.5,25 | 36.7,7.7 ARM.P$3
UI_DELAY  (via drill 0.35)
  Top 0.2: v26.7,25 27.8,23.8 27.8,5.1 27.1,4.4 20.7,4.4 20.1,3.8 SEL.P1-2
  Bottom 0.2: U$3.38 27.8,23.8 v26.7,25
UI_MODE  (via drill 0.35)
  Top 0.2: v26.7,23.9 27.3,23.3 27.3,8.6 26.4,7.7 13.25,7.7 13.25,5
  Top 0.4: MODE.P$4 13.25,7.7 13.25,5 MODE.P$3
  Bottom 0.2: U$3.37 27.3,23.3 v26.7,23.9
UI_MODE_1.A
  Bottom 0.2: R7.P$2.1 5.6,8.4 5.8,8.2 6.9,7.1 7.2,6.8 7.3,6.7 7.8,6.7 9.6,6.7 14.8,6.7 | 14.8,6.7 17.9,9.8 | U$3.25 21.6,16.8 19.8,15 19.8,11.7 14.8,6.7
UI_MODE_1.B
  Bottom 0.2: R7.P$1.1 4.8,8.2 5.1,7.9 5.3,7.7 5.4,7.6 6.9,6.2 9.9,6.2 15.1,6.2 18.7,9.8 21.9,13 25.2,13 25.8,13.6 U$3.22
UI_MODE_2.A
  Bottom 0.2: R7.P$4.1 11.6,9.1 12.4,9.9 14.3,11.8 14.5,12 18.4,12 19.2,12.8 19.2,15.1 21.4,17.3 22.1,17.3 U$3.26
UI_MODE_2.B
  Bottom 0.2: R7.P$3.1 6.4,9.7 6.6,9.9 11.8,9.9 | 11.8,9.9 12.2,10.3 | 11.8,9.9 12.2,10.3 | 12.2,10.3 14.3,12.4 18,12.4 18.6,13 18.6,15.2 21.2,17.8 21.9,17.8 U$3.27
UI_SCALE.A  (via drill 0.35)
  Top 0.2: v29.4,25 29.3,24.9 29.3,14.5 29.6,14.2 v35,14.2
  Bottom 0.2: U$3.41 29.3,23 29.3,24.9 v29.4,25 | v35,14.2 42.3,14.2 43,13.5 R5.1 43.05,10.9 45,10.9 45.6,11.5 45.63,11.53 JP1.2
UI_THRESH  (via drill 0.35)
  Top 0.2: v27.6,25 28.3,24.3 28.3,11 29.9,9.4 29.9,6.5 SEL.P2-2
  Bottom 0.2: U$3.39 28.3,24.3 v27.6,25
UI_TRIGGER.A
  Bottom 0.2: R15.P$1.1 38.6,6.8 38.4,6.6 28.2,6.6 27.8,7 U$3.18
UI_TRIGGER.B
  Bottom 0.2: U$3.19 27.3,6.9 28.2,6 39.1,6 39.4,6.3 R15.P$2.1
USB_D+
  Bottom 0.2: U$3.4 32.7,19.3 33,19.6 33.2,19.8 33.3,19.9 R1.P$1.2
USB_D-
  Bottom 0.2: U$3.3 32.6,19.8 33.1,20.3 33.4,20.6 33.5,20.7 R1.P$2.2
VBUS
  Bottom 0.2: U$3.7 31.1,17.8 30.8,18.1 30.8,20.1 31,20.3 U$3.2 32.6,20.3 33,20.7 33,21.4 33.2,21.6 40.7,21.6 41,21.9 41,25.5 41.8,26.3 41.8,27.05 D3.2
  Bottom 0.4: F1.2 D3.2
XTAL1  (1 unrouted)
XTAL2  (1 unrouted)

### Text on the board
tPlace: 6-12V | CAMERA | FLASH | IR | RING | - | LIGHT | TIP | 5V | + | MIC IN | FACT | Flash and / Camera / Trigger | 64 | SOUND | LIGHT | ms | 0 | 128 | www.justgeek.de | .5s | FACT / v0.2u | ARM | 2s | MODE | THRESHHOLD | DELAY
bPlace: LIGHT | SOUND | - | + | - | + | fact / v0.3u | www.justgeek.de/fact